# EAGLE design openmv (EAGLE 6.1)
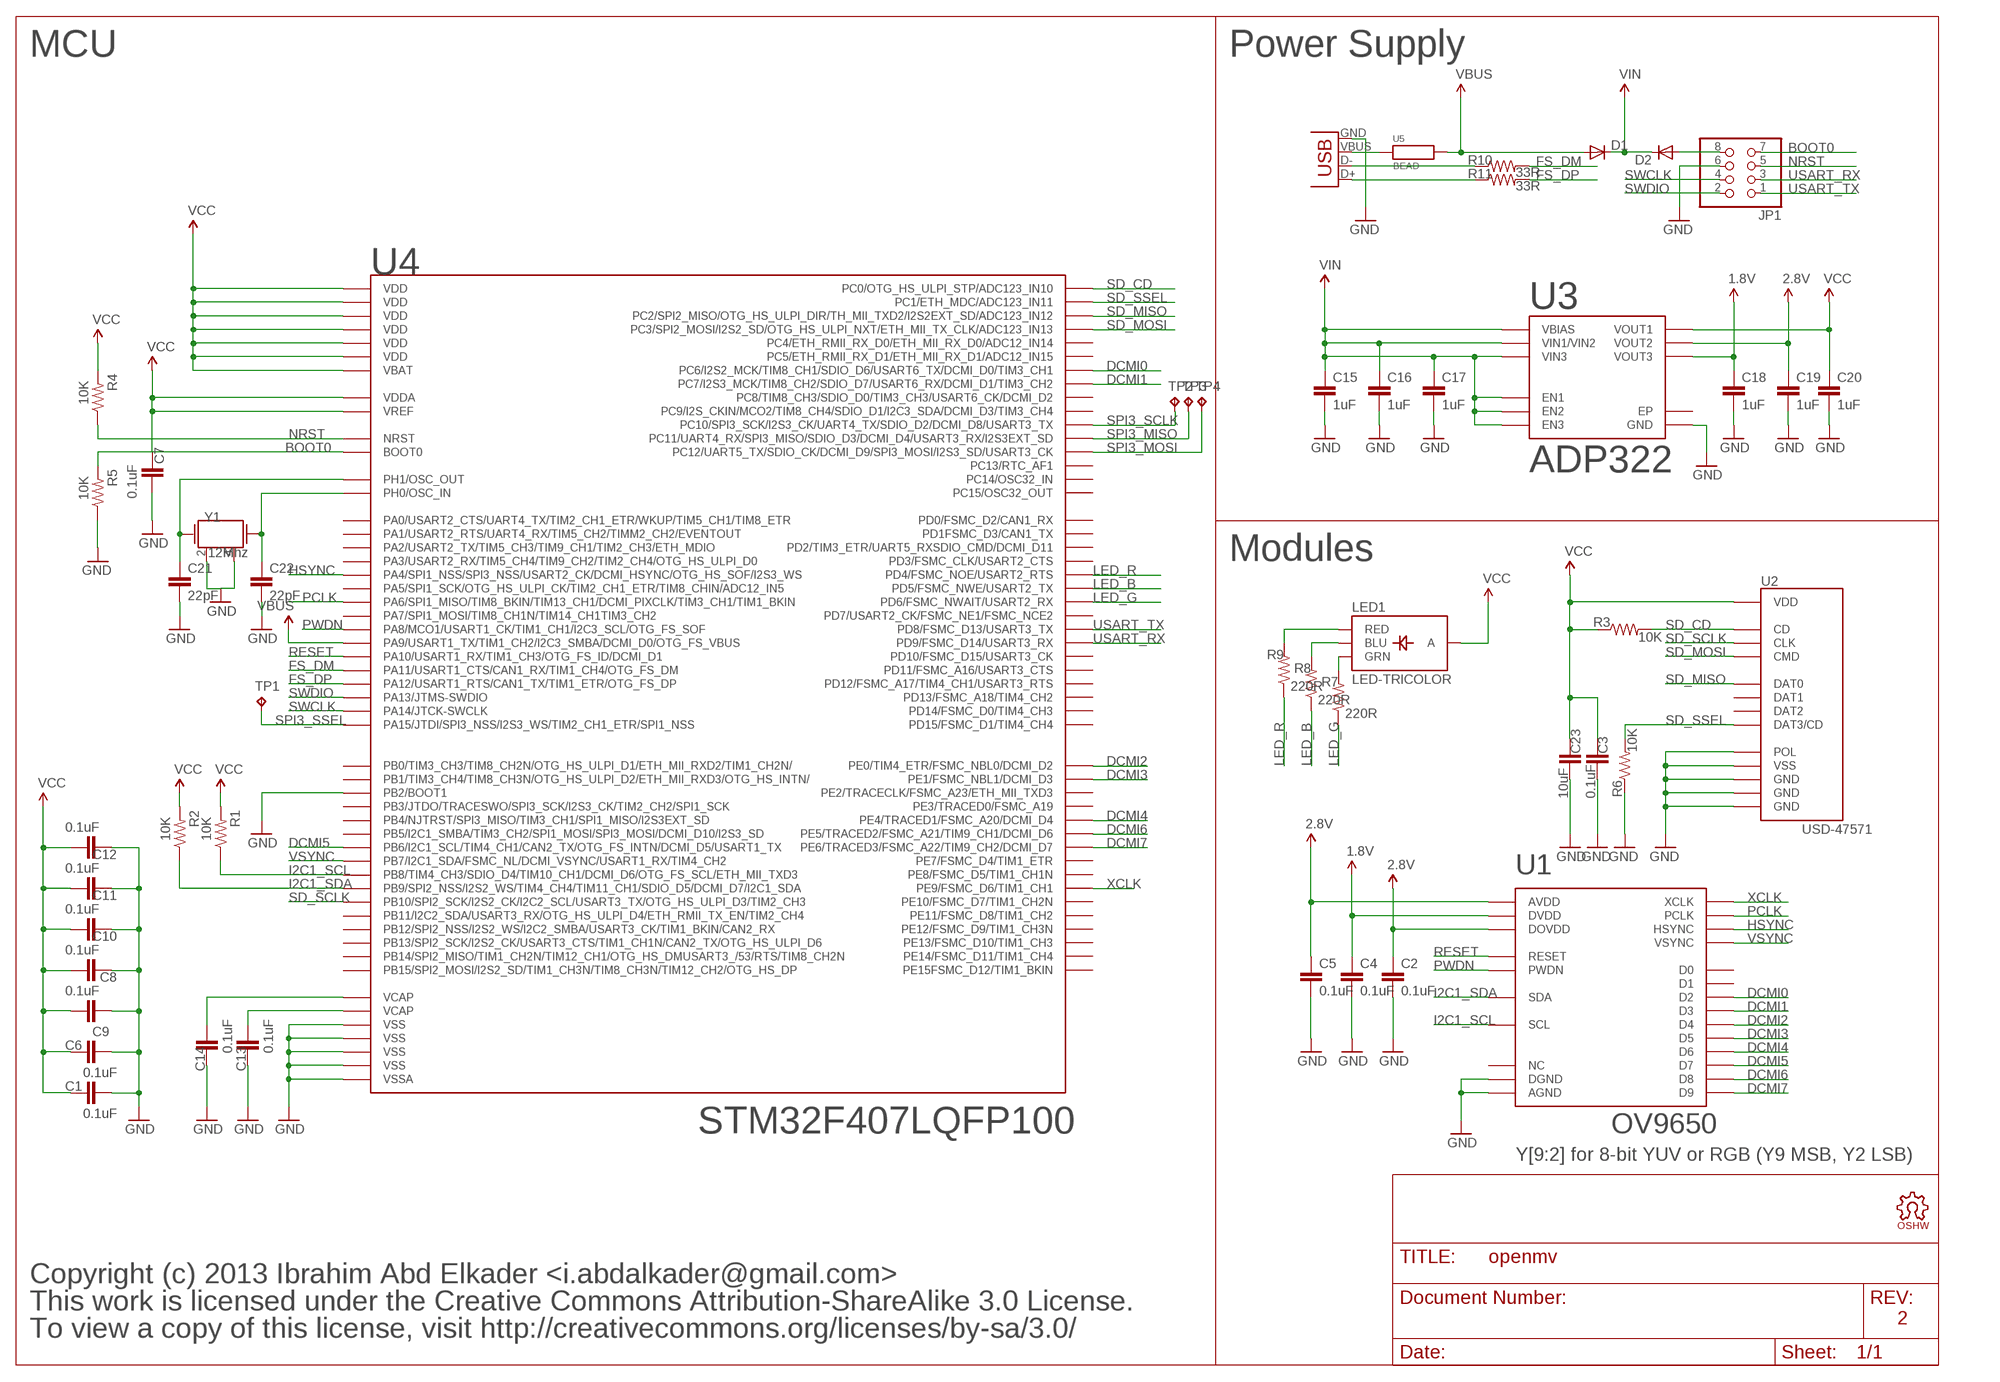
[diagram p0: schematic, sheet 1]

## Parts
C1  0.1uF  CAP0402-CAP  [0402-CAP]
C2  0.1uF  CAP0402-CAP  [0402-CAP]
C3  0.1uF  CAP0402-CAP  [0402-CAP]
C4  0.1uF  CAP0402-CAP  [0402-CAP]
C5  0.1uF  CAP0402-CAP  [0402-CAP]
C6  0.1uF  CAP0402-CAP  [0402-CAP]
C7  0.1uF  CAP0402-CAP  [0402-CAP]
C8  0.1uF  CAP0402-CAP  [0402-CAP]
C9  0.1uF  CAP0402-CAP  [0402-CAP]
C10  0.1uF  CAP0402-CAP  [0402-CAP]
C11  0.1uF  CAP0402-CAP  [0402-CAP]
C12  0.1uF  CAP0402-CAP  [0402-CAP]
C13  0.1uF  CAP0402-CAP  [0402-CAP]
C14  0.1uF  CAP0402-CAP  [0402-CAP]
C15  1uF  CAP0402-CAP  [0402-CAP]
C16  1uF  CAP0402-CAP  [0402-CAP]
C17  1uF  CAP0402-CAP  [0402-CAP]
C18  1uF  CAP0402-CAP  [0402-CAP]
C19  1uF  CAP0402-CAP  [0402-CAP]
C20  1uF  CAP0402-CAP  [0402-CAP]
C21  22pF  CAP0402-CAP  [0402-CAP]
C22  22pF  CAP0402-CAP  [0402-CAP]
C23  10uF  CAP0805  [0805]
D1  DIODESOD  [SOD-323]
D2  DIODESOD  [SOD-323]
JP1  PINHD-2X4  [2X04]
LED1  LED-TRICOLOR  [LED-TRICOLOR-SMD]
LOGO1  OSHW_LOGO_FILLX0150-NT  [OSHW_FILLX150_NOTEXT]
R1  10K  RESISTOR0402-RES  [0402-RES]
R2  10K  RESISTOR0402-RES  [0402-RES]
R3  10K  RESISTOR0402-RES  [0402-RES]
R4  10K  RESISTOR0402-RES  [0402-RES]
R5  10K  RESISTOR0402-RES  [0402-RES]
R6  10K  RESISTOR0402-RES  [0402-RES]
R7  220R  RESISTOR0402-RES  [0402-RES]
R8  220R  RESISTOR0402-RES  [0402-RES]
R9  220R  RESISTOR0402-RES  [0402-RES]
R10  33R  RESISTOR0402-RES  [0402-RES]
R11  33R  RESISTOR0402-RES  [0402-RES]
TP1  TPTP10R  [TP10R]
TP2  TPTP10R  [TP10R]
TP3  TPTP10R  [TP10R]
TP4  TPTP10R  [TP10R]
U1  OV9650  [OV9650]
U2  USD-47571  [USD-47571]
U3  ADP322  [WFQFN-16]
U4  STM32F407LQFP100  [LQFP100]
U5  BEAD  [0402-CAP]
X1  USB-MICROB  [USB-MICROB]
Y1  12Mhz  CRYSTAL5X3  [CRYSTAL-SMD-5X3]

## Nets
1.8V: C4.1 C18.1 U1.P$10(DVDD) U3.8(VOUT3)
2.8V: C2.1 C5.1 C19.1 U1.P$4(AVDD) U1.P$11(DOVDD) U3.6(VOUT2)
BOOT0: JP1.7 R5.2 U4.94(BOOT0)
DCMI0: U1.P$19(D2) U4.63(PC6/I2S2_MCK/TIM8_CH1/SDIO_D6/USART6_TX/DCMI_D0/TIM3_CH1)
DCMI1: U1.P$21(D3) U4.64(PC7/I2S3_MCK/TIM8_CH2/SDIO_D7/USART6_RX/DCMI_D1/TIM3_CH2)
DCMI2: U1.P$22(D4) U4.97(PE0/TIM4_ETR/FSMC_NBL0/DCMI_D2)
DCMI3: U1.P$20(D5) U4.98(PE1/FSMC_NBL1/DCMI_D3)
DCMI4: U1.P$18(D6) U4.3(PE4/TRACED1/FSMC_A20/DCMI_D4)
DCMI5: U1.P$16(D7) U4.92(PB6/I2C1_SCL/TIM4_CH1/CAN2_TX/OTG_FS_INTN/DCMI_D5/USART1_TX)
DCMI6: U1.P$14(D8) U4.4(PE5/TRACED2/FSMC_A21/TIM9_CH1/DCMI_D6)
DCMI7: U1.P$12(D9) U4.5(PE6/TRACED3/FSMC_A22/TIM9_CH2/DCMI_D7)
FS_DM: R10.2 U4.70(PA11/USART1_CTS/CAN1_RX/TIM1_CH4/OTG_FS_DM)
FS_DP: R11.2 U4.71(PA12/USART1_RTS/CAN1_TX/TIM1_ETR/OTG_FS_DP)
GND: C1.1 C2.2 C3.2 C4.2 C5.2 C6.1 C7.1 C8.2 C9.1 C10.2 C11.2 C12.2 C13.2 C14.2 C15.2 C16.2 C17.2 C18.2 C19.2 C20.2 C21.2 C22.2 C23.2 JP1.6 R5.1 R6.1 U1.P$2(AGND) U1.P$15(DGND) U2.G$1(GND) U2.G$2(GND) U2.G$3(GND) U2.G$4(POL) U2.P$6(VSS) U3.12(GND) U4.10(VSS) U4.20(VSSA) U4.27(VSS) U4.37(PB2/BOOT1) U4.74(VSS) U4.99(VSS) X1.GND Y1.2 Y1.4
HSYNC: U1.P$9(HSYNC) U4.29(PA4/SPI1_NSS/SPI3_NSS/USART2_CK/DCMI_HSYNC/OTG_HS_SOF/I2S3_WS)
I2C1_SCL: R1.1 U1.P$5(SCL) U4.95(PB8/TIM4_CH3/SDIO_D4/TIM10_CH1/DCMI_D6/OTG_FS_SCL/ETH_MII_TXD3)
I2C1_SDA: R2.1 U1.P$3(SDA) U4.96(PB9/SPI2_NSS/I2S2_WS/TIM4_CH4/TIM11_CH1/SDIO_D5/DCMI_D7/I2C1_SDA)
LED_B: R8.1 U4.86(PD5/FSMC_NWE/USART2_TX)
LED_G: R7.1 U4.87(PD6/FSMC_NWAIT/USART2_RX)
LED_R: R9.1 U4.85(PD4/FSMC_NOE/USART2_RTS)
N$6: LED1.G(GRN) R7.2
N$7: LED1.B(BLU) R8.2
N$9: C21.1 U4.13(PH1/OSC_OUT) Y1.1
N$10: C22.1 U4.12(PH0/OSC_IN) Y1.3
N$16: LED1.R(RED) R9.2
N$20: R10.1 X1.D-
N$21: R11.1 X1.D+
N$22: U5.1 X1.VBUS
NRST: JP1.5 R4.1 U4.14(NRST)
PCLK: U1.P$17(PCLK) U4.31(PA6/SPI1_MISO/TIM8_BKIN/TIM13_CH1/DCMI_PIXCLK/TIM3_CH1/TIM1_BKIN)
PWDN: U1.P$8(PWDN) U4.67(PA8/MCO1/USART1_CK/TIM1_CH1/I2C3_SCL/OTG_FS_SOF)
RAW: D2.2(A) JP1.8
RESET: U1.P$6(RESET) U4.69(PA10/USART1_RX/TIM1_CH3/OTG_FS_ID/DCMI_D1)
SD_CD: R3.2 U2.G$5(CD) U4.15(PC0/OTG_HS_ULPI_STP/ADC123_IN10)
SD_MISO: U2.P$7(DAT0) U4.17(PC2/SPI2_MISO/OTG_HS_ULPI_DIR/TH_MII_TXD2/I2S2EXT_SD/ADC123_IN12)
SD_MOSI: U2.P$3(CMD) U4.18(PC3/SPI2_MOSI/I2S2_SD/OTG_HS_ULPI_NXT/ETH_MII_TX_CLK/ADC123_IN13)
SD_SCLK: U2.P$5(CLK) U4.47(PB10/SPI2_SCK/I2S2_CK/I2C2_SCL/USART3_TX/OTG_HS_ULPI_D3/TIM2_CH3)
SD_SSEL: R6.2 U2.P$2(DAT3/CD) U4.16(PC1/ETH_MDC/ADC123_IN11)
SPI3_MISO: TP3.TP U4.79(PC11/UART4_RX/SPI3_MISO/SDIO_D3/DCMI_D4/USART3_RX/I2S3EXT_SD)
SPI3_MOSI: TP4.TP U4.80(PC12/UART5_TX/SDIO_CK/DCMI_D9/SPI3_MOSI/I2S3_SD/USART3_CK)
SPI3_SCLK: TP2.TP U4.78(PC10/SPI3_SCK/I2S3_CK/UART4_TX/SDIO_D2/DCMI_D8/USART3_TX)
SPI3_SSEL: TP1.TP U4.77(PA15/JTDI/SPI3_NSS/I2S3_WS/TIM2_CH1_ETR/SPI1_NSS)
SWCLK: JP1.4 U4.76(PA14/JTCK-SWCLK)
SWDIO: JP1.2 U4.72(PA13/JTMS-SWDIO)
USART_RX: JP1.3 U4.56(PD9/FSMC_D14/USART3_RX)
USART_TX: JP1.1 U4.55(PD8/FSMC_D13/USART3_TX)
VBUS: D1.2(A) U4.68(PA9/USART1_TX/TIM1_CH2/I2C3_SMBA/DCMI_D0/OTG_FS_VBUS) U5.2
VCAP1: C14.1 U4.49(VCAP)
VCAP2: C13.1 U4.73(VCAP)
VCC: C1.2 C3.1 C6.2 C7.2 C8.1 C9.2 C10.1 C11.1 C12.1 C20.1 C23.1 LED1.A R1.2 R2.2 R3.1 R4.2 U2.P$4(VDD) U3.5(VOUT1) U4.6(VBAT) U4.11(VDD) U4.19(VDD) U4.21(VREF) U4.22(VDDA) U4.28(VDD) U4.50(VDD) U4.75(VDD) U4.100(VDD)
VIN: C15.1 C16.1 C17.1 D1.1(C) D2.1(C) U3.1(EN1) U3.2(VBIAS) U3.3(VIN1/VIN2) U3.10(VIN3) U3.15(EN3) U3.16(EN2)
VSYNC: U1.P$7(VSYNC) U4.93(PB7/I2C1_SDA/FSMC_NL/DCMI_VSYNC/USART1_RX/TIM4_CH2)
XCLK: U1.P$13(XCLK) U4.40(PE9/FSMC_D6/TIM1_CH1)
Unconnected: U1.P$1(NC) U1.P$23(D1) U1.P$24(D0) U2.P$1(DAT2) U2.P$8(DAT1) U3.4(NC) U3.7(NC) U3.9(NC) U3.11(NC) U3.13(NC) U3.14(NC) U3.EXP(EP) U4.1(PE2/TRACECLK/FSMC_A23/ETH_MII_TXD3) U4.2(PE3/TRACED0/FSMC_A19) U4.7(PC13/RTC_AF1) U4.8(PC14/OSC32_IN) U4.9(PC15/OSC32_OUT) U4.23(PA0/USART2_CTS/UART4_TX/TIM2_CH1_ETR/WKUP/TIM5_CH1/TIM8_ETR) U4.24(PA1/USART2_RTS/UART4_RX/TIM5_CH2/TIMM2_CH2/EVENTOUT) U4.25(PA2/USART2_TX/TIM5_CH3/TIM9_CH1/TIM2_CH3/ETH_MDIO) U4.26(PA3/USART2_RX/TIM5_CH4/TIM9_CH2/TIM2_CH4/OTG_HS_ULPI_D0) U4.30(PA5/SPI1_SCK/OTG_HS_ULPI_CK/TIM2_CH1_ETR/TIM8_CHIN/ADC12_IN5) U4.32(PA7/SPI1_MOSI/TIM8_CH1N/TIM14_CH1TIM3_CH2) U4.33(PC4/ETH_RMII_RX_D0/ETH_MII_RX_D0/ADC12_IN14) U4.34(PC5/ETH_RMII_RX_D1/ETH_MII_RX_D1/ADC12_IN15) U4.35(PB0/TIM3_CH3/TIM8_CH2N/OTG_HS_ULPI_D1/ETH_MII_RXD2/TIM1_CH2N/) U4.36(PB1/TIM3_CH4/TIM8_CH3N/OTG_HS_ULPI_D2/ETH_MII_RXD3/OTG_HS_INTN/) U4.38(PE7/FSMC_D4/TIM1_ETR) U4.39(PE8/FSMC_D5/TIM1_CH1N) U4.41(PE10/FSMC_D7/TIM1_CH2N) U4.42(PE11/FSMC_D8/TIM1_CH2) U4.43(PE12/FSMC_D9/TIM1_CH3N) U4.44(PE13/FSMC_D10/TIM1_CH3) U4.45(PE14/FSMC_D11/TIM1_CH4) U4.46(PE15FSMC_D12/TIM1_BKIN) U4.48(PB11/I2C2_SDA/USART3_RX/OTG_HS_ULPI_D4/ETH_RMII_TX_EN/TIM2_CH4) U4.51(PB12/SPI2_NSS/I2S2_WS/I2C2_SMBA/USART3_CK/TIM1_BKIN/CAN2_RX) U4.52(PB13/SPI2_SCK/I2S2_CK/USART3_CTS/TIM1_CH1N/CAN2_TX/OTG_HS_ULPI_D6) U4.53(PB14/SPI2_MISO/TIM1_CH2N/TIM12_CH1/OTG_HS_DMUSART3_/53/RTS/TIM8_CH2N) U4.54(PB15/SPI2_MOSI/I2S2_SD/TIM1_CH3N/TIM8_CH3N/TIM12_CH2/OTG_HS_DP) U4.57(PD10/FSMC_D15/USART3_CK) U4.58(PD11/FSMC_A16/USART3_CTS) U4.59(PD12/FSMC_A17/TIM4_CH1/USART3_RTS) U4.60(PD13/FSMC_A18/TIM4_CH2) U4.61(PD14/FSMC_D0/TIM4_CH3) U4.62(PD15/FSMC_D1/TIM4_CH4) U4.65(PC8/TIM8_CH3/SDIO_D0/TIM3_CH3/USART6_CK/DCMI_D2) U4.66(PC9/I2S_CKIN/MCO2/TIM8_CH4/SDIO_D1/I2C3_SDA/DCMI_D3/TIM3_CH4) U4.81(PD0/FSMC_D2/CAN1_RX) U4.82(PD1FSMC_D3/CAN1_TX) U4.83(PD2/TIM3_ETR/UART5_RXSDIO_CMD/DCMI_D11) U4.84(PD3/FSMC_CLK/USART2_CTS) U4.88(PD7/USART2_CK/FSMC_NE1/FSMC_NCE2) U4.89(PB3/JTDO/TRACESWO/SPI3_SCK/I2S3_CK/TIM2_CH2/SPI1_SCK) U4.90(PB4/NJTRST/SPI3_MISO/TIM3_CH1/SPI1_MISO/I2S3EXT_SD) U4.91(PB5/I2C1_SMBA/TIM3_CH2/SPI1_MOSI/SPI3_MOSI/DCMI_D10/I2S3_SD)

## Notes on the sheet
- MCU | Power Supply
- Modules
- Y[9:2] for 8-bit YUV or RGB (Y9 MSB, Y2 LSB)
- Copyright (c) 2013 Ibrahim Abd Elkader <i.abdalkader@gmail.com>
- This work is licensed under the Creative Commons Attribution-ShareAlike 3.0 License.
- 2
- To view a copy of this license, visit http://creativecommons.org/licenses/by-sa/3.0/

## Library data of the parts
C1-C23 = sfe:CAP: Capacitor Standard 0603 ceramic capacitor, and 0.1" leaded capacitor.
D1 D2 = sfe:DIODE: Diode These are standard reverse protection diodes and small signal diodes. SMA package can handle up to about 1A. SOD-323 can handle about 200mA. What the SOD-323 package when ordering, there are some mfgs out there that are 5-pin packages.
JP1 = pinhead:PINHD-2X4: PIN HEADER
LED1 = sfe:LED-TRICOLOR: Tri-Color LED SMD Proven layout and schematic for triple color LED in SMD package - common anode. Spark Fun Electronics SKU : COM-07844
LOGO1 = iofault:OSHW_LOGO_FILL
R1-R11 = sfe:RESISTOR: Resistor Basic schematic elements and footprints for 0603, 1206, and PTH resistors.
TP1-TP4 = testpad:TP: Test pad
U1 = iofault:OV9650
U2 = mux:USD-47571
U3 = iofault:ADP322
U4 = mux:STM32F407
U5 = heka:BEAD
X1 = sfe:USB: USB Connectors USB-B-PTH is fully proven SKU : PRT-00139 USB-miniB is fully proven SKU : PRT-00587 USB-A-PCB is untested. USB-A-H is throughly reviewed, but untested. Spark Fun Electronics SKU : PRT-00437 USB-B-SMT is throughly reviewed, but untested. Needs silkscreen touching up. USB-A-S has not been used/tested USB-MB-H has not been used/tested
Y1 = mux:CRYSTAL: Crystals Various standard crystals. Proven footprints. Spark Fun Electronics SKU : COM-00534

## Board
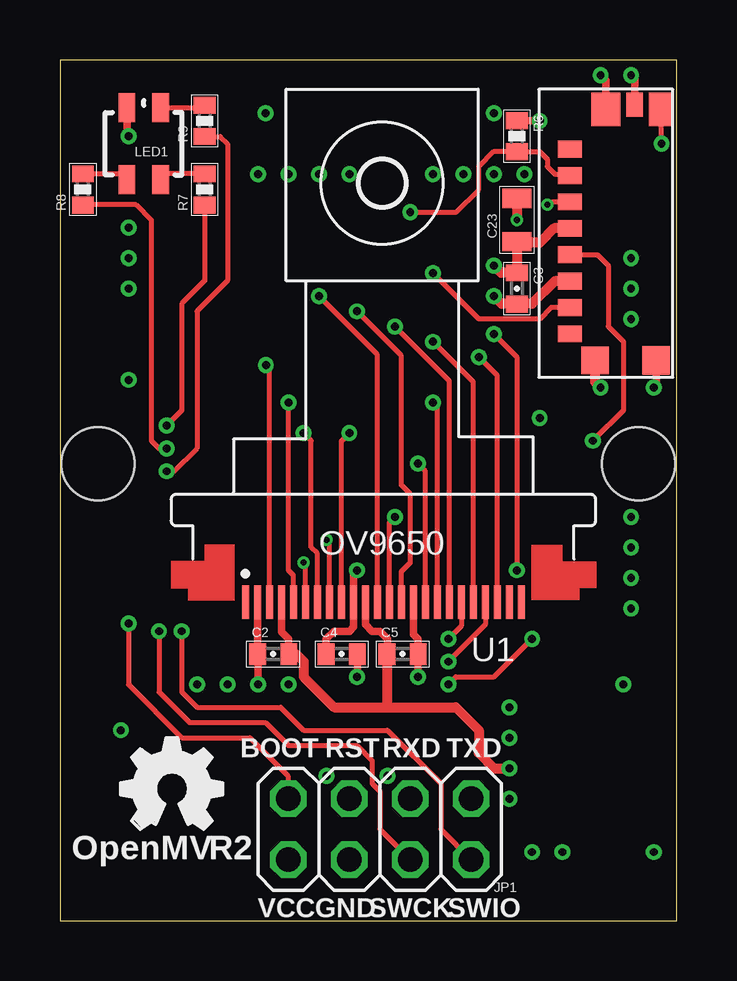
[diagram p1: board, top side]
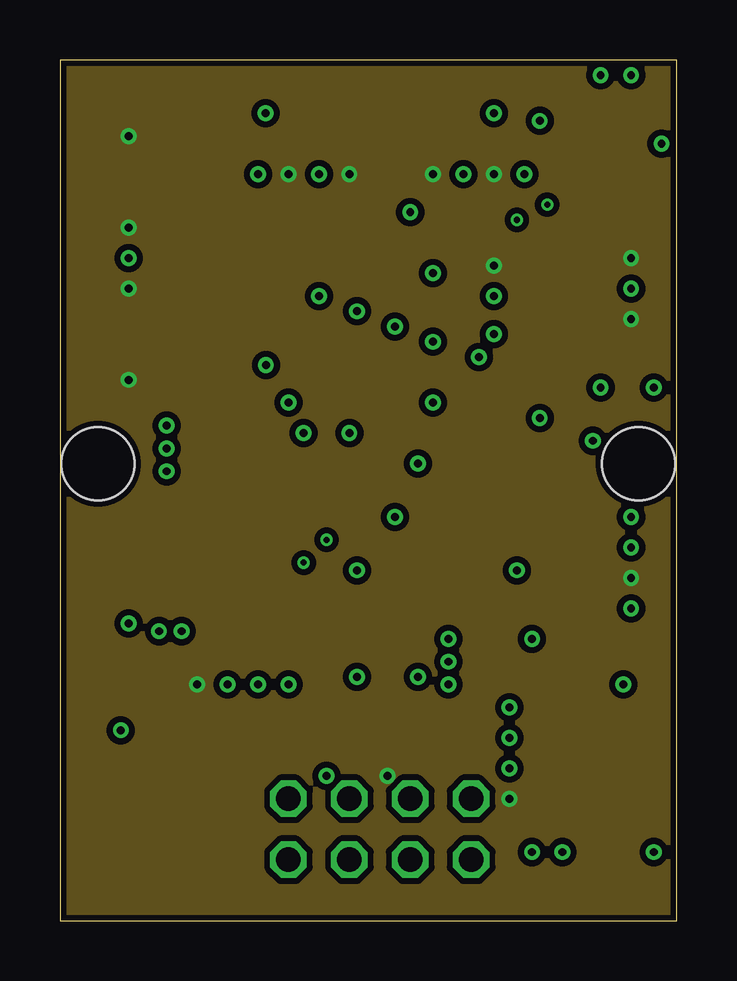
[diagram p2: board, inner layer Route2]
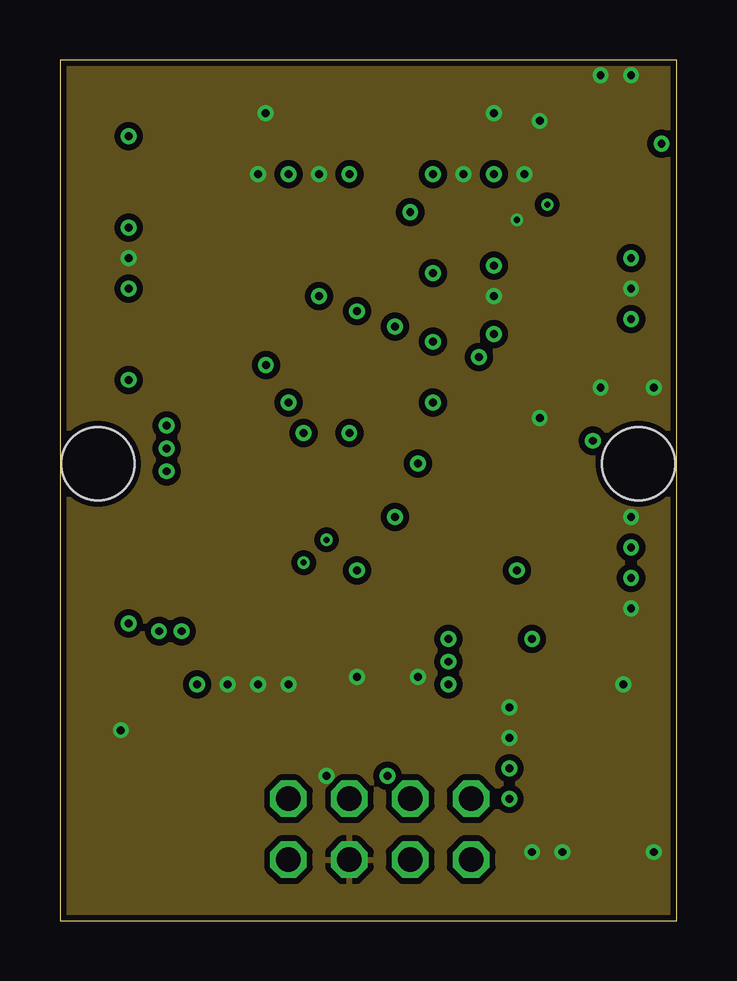
[diagram p3: board, inner layer Route15]
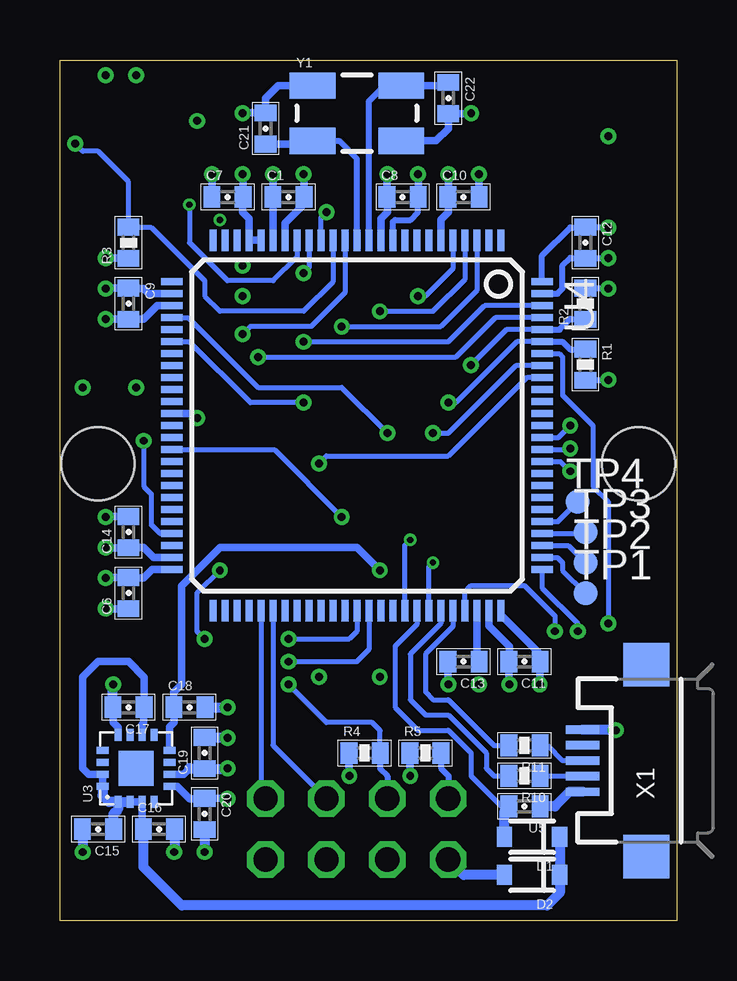
[diagram p4: board, bottom side, seen from below]

Size 25.72 x 35.88 mm. Coordinates in mm from the lower left corner, seen from the top.
Outline: 0,0 25.72,0 25.72,35.88 0,35.88 0,0
Copper layers (1*2+15*16): Top 0.035mm / dielectric 1.5mm / Route2 0.035mm / dielectric 0.15mm / Route15 0.035mm / dielectric 0.2mm / Bottom 0.035mm
Design rules: minimum track width 8mil, minimum drill 10mil, track to track 6mil, track to pad 6mil, pad to pad 6mil, via to via 6mil, smd to smd 6mil, copper to edge 10mil, drill to drill 10mil, minimum pad ring 10mil, minimum via ring 4mil, stop-mask expansion 2mil, vias tented up to drill 20mil, thermal gap 10mil
Holes 3.05 mm at 1.59,19.05 24.13,19.05

### Footprints (pad centres in the part's own frame; a part is rotated, then mirrored left to right if it is on the bottom)
0402-CAP = smd 0.7 x 0.9: 1 -0.65,0; 2 0.65,0
0805 = smd 0.8 x 1.2: 1 -0.9,0; 2 0.9,0
SOD-323 = smd 0.63 x 0.83: 1 -1.15,0; 2 1.15,0
2X04 = drill 1.016 octagon: 1 -3.81,-1.27; 2 -3.81,1.27; 3 -1.27,-1.27; 4 -1.27,1.27; 5 1.27,-1.27; 6 1.27,1.27; 7 3.81,-1.27; 8 3.81,1.27
LED-TRICOLOR-SMD = smd 0.7 x 1.2: A 0.7,-1.5; B 0.7,1.5; G -0.7,1.5; R -0.7,-1.5
0402-RES = smd 0.7 x 0.9: 1 -0.65,0; 2 0.65,0
TP10R = smd 1 x 1: TP 0,0
OV9650 = smd 0.3 x 1.4: P$1 -5.6,-11.5; P$2 -5.1,-11.5; P$3 -4.6,-11.5; P$4 -4.1,-11.5; P$5 -3.6,-11.5; P$6 -3.1,-11.5; P$7 -2.6,-11.5; P$8 -2.1,-11.5; P$9 -1.6,-11.5; P$10 -1.1,-11.5; P$11 -0.6,-11.5; P$12 -0.1,-11.5; P$13 0.4,-11.5; P$14 0.9,-11.5; P$15 1.4,-11.5; P$16 1.9,-11.5; P$17 2.4,-11.5; P$18 2.9,-11.5; P$19 3.4,-11.5; P$20 3.9,-11.5; P$21 4.4,-11.5; P$22 4.9,-11.5; P$23 5.4,-11.5; P$24 5.9,-11.5
USD-47571 = smd 1.15 x 1.15: G$1 -4.9,0.55 | smd 1.2 x 1.15: G$2 -4.9,-2 | smd 1.4 x 1.2: G$3 5.55,0.1 | smd 1 x 0.7: G$4 5.75,-1.1 | smd 1.4 x 0.9: G$5 5.55,-2.15 | smd 0.7 x 1: P$1 3.9,1.6; P$2 2.8,1.6; P$3 1.7,1.6; P$4 0.6,1.6; P$5 -0.5,1.6; P$6 -1.6,1.6; P$7 -2.7,1.6; P$8 -3.8,1.6
WFQFN-16 = smd 0.5 x 0.3: 1 -1.4,0.75; 2 -1.4,0.25; 3 -1.4,-0.25; 4 -1.4,-0.75; 9 1.4,-0.75; 10 1.4,-0.25; 11 1.4,0.25; 12 1.4,0.75 | smd 0.3 x 0.5: 5 -0.75,-1.4; 6 -0.25,-1.4; 7 0.25,-1.4; 8 0.75,-1.4; 13 0.75,1.4; 14 0.25,1.4; 15 -0.25,1.4; 16 -0.75,1.4 | smd 1.45 x 1.45: EXP 0,0
LQFP100 = smd 0.9 x 0.3: 1 -7.72,6; 2 -7.72,5.5; 3 -7.72,5; 4 -7.72,4.5; 5 -7.72,4; 6 -7.72,3.5; 7 -7.72,3; 8 -7.72,2.5; 9 -7.72,2; 10 -7.72,1.5; 11 -7.72,1; 12 -7.72,0.5; 13 -7.72,0; 14 -7.72,-0.5; 15 -7.72,-1; 16 -7.72,-1.5; 17 -7.72,-2; 18 -7.72,-2.5; 19 -7.72,-3; 20 -7.72,-3.5; 21 -7.72,-4; 22 -7.72,-4.5; 23 -7.72,-5; 24 -7.72,-5.5; 25 -7.72,-6; 51 7.72,-6; 52 7.72,-5.5; 53 7.72,-5; 54 7.72,-4.5; 55 7.72,-4; 56 7.72,-3.5; 57 7.72,-3; 58 7.72,-2.5; 59 7.72,-2; 60 7.72,-1.5; 61 7.72,-1; 62 7.72,-0.5; 63 7.72,0; 64 7.72,0.5; 65 7.72,1; 66 7.72,1.5; 67 7.72,2; 68 7.72,2.5; 69 7.72,3; 70 7.72,3.5; 71 7.72,4; 72 7.72,4.5; 73 7.72,5; 74 7.72,5.5; 75 7.72,6 | smd 0.3 x 0.9: 26 -6,-7.72; 27 -5.5,-7.72; 28 -5,-7.72; 29 -4.5,-7.72; 30 -4,-7.72; 31 -3.5,-7.72; 32 -3,-7.72; 33 -2.5,-7.72; 34 -2,-7.72; 35 -1.5,-7.72; 36 -1,-7.72; 37 -0.5,-7.72; 38 0,-7.72; 39 0.5,-7.72; 40 1,-7.72; 41 1.5,-7.72; 42 2,-7.72; 43 2.5,-7.72; 44 3,-7.72; 45 3.5,-7.72; 46 4,-7.72; 47 4.5,-7.72; 48 5,-7.72; 49 5.5,-7.72; 50 6,-7.72; 76 6,7.72; 77 5.5,7.72; 78 5,7.72; 79 4.5,7.72; 80 4,7.72; 81 3.5,7.72; 82 3,7.72; 83 2.5,7.72; 84 2,7.72; 85 1.5,7.72; 86 1,7.72; 87 0.5,7.72; 88 0,7.72; 89 -0.5,7.72; 90 -1,7.72; 91 -1.5,7.72; 92 -2,7.72; 93 -2.5,7.72; 94 -3,7.72; 95 -3.5,7.72; 96 -4,7.72; 97 -4.5,7.72; 98 -5,7.72; 99 -5.5,7.72; 100 -6,7.72
USB-MICROB = smd 0.35 x 1.4: D+ 0,2.65; D- -0.65,2.65; GND 1.3,2.65; ID 0.65,2.65; VBUS -1.3,2.65 | smd 1.8 x 1.9: MT1 -4,0; MT2 4,0
CRYSTAL-SMD-5X3 = smd 1.9 x 1.1: 1 -1.85,-1.15; 2 1.85,-1.15; 3 1.85,1.15; 4 -1.85,1.15

### Placement (x,y rotation side)
C1  16.19,30.16 0 bottom
C2  8.89,11.11 180 top
C3  19.05,26.35 270 top
C4  11.75,11.11 0 top
C5  14.29,11.11 0 top
C6  22.86,13.65 90 bottom
C7  18.73,30.16 0 bottom
C8  11.43,30.16 0 bottom
C9  22.86,25.72 270 bottom
C10  8.89,30.16 0 bottom
C11  6.35,10.79 180 bottom
C12  3.81,28.26 270 bottom
C13  8.89,10.79 180 bottom
C14  22.86,16.19 90 bottom
C15  24.13,3.81 180 bottom
C16  21.59,3.81 0 bottom
C17  22.86,8.89 180 bottom
C18  20.32,8.89 0 bottom
C19  19.68,6.99 90 bottom
C20  19.68,4.45 270 bottom
C21  17.14,33.02 90 bottom
C22  9.53,34.29 270 bottom
C23  19.05,29.21 90 top
D1  6.03,3.49 180 bottom
D2  6.03,1.91 180 bottom
JP1  13.34,3.81 180 top
LED1  3.49,32.38 180 top
LOGO1  2.54,3.81 0 top
R1  3.81,23.18 270 bottom
R2  3.81,25.72 90 bottom
R3  22.86,28.26 90 bottom
R4  13.02,6.99 180 bottom
R5  10.48,6.99 0 bottom
R6  19.05,32.7 270 top
R7  6.03,30.48 90 top
R8  0.95,30.48 90 top
R9  6.03,33.34 90 top
R10  6.35,6.03 180 bottom
R11  6.35,7.3 180 bottom
TP1  3.81,13.65 0 bottom
TP2  3.81,14.92 0 bottom
TP3  3.81,16.19 0 bottom
TP4  4.13,17.46 0 bottom
U1  13.34,24.77 0 top
U2  22.86,28.26 90 top
U3  22.54,6.35 90 bottom
U4  13.34,20.64 270 bottom
U5  6.35,4.76 180 bottom
X1  1.27,6.67 90 bottom
Y1  13.34,33.66 0 bottom

### Tracks (layer width: path | path; a pad name or v marks a point on that pad's centre or on a via)
1.8V  (via drill 0.33)
  Top 0.305: v12.38,14.61 12.23,14.46 U1.P$10 12.23,12.23 12.06,12.06 11.43,12.06 11.1,11.73 C4.1
  Bottom 0.305: U3.8 21.14,8.07 20.95,8.26 20.95,8.88 C18.1 20.97,9.51 20.64,9.84 20.64,13.94 20.65,13.96 19.05,15.56 13.34,15.56 v12.38,14.61
2.8V  (via drill 0.33)
  Top 0.305: U1.P$4 9.23,12.04 9.53,11.75 9.53,11.13 | U1.P$11 12.73,12.35 13.02,12.06 13.34,12.06 13.65,11.75 13.65,11.13 C5.1
  Top 0.406: 13.65,8.89 11.43,8.89 10.16,10.16 10.16,10.79 9.84,11.11 C2.1 9.53,11.13 | 13.65,8.89 16.51,8.89 17.46,7.94 17.46,6.99 18.1,6.35 v18.73,6.35 | C5.1 13.64,8.9 13.65,8.89
  Bottom 0.305: U3.6 20.57,6.1 20.32,6.35
  Bottom 0.406: v18.73,6.35 18.75,6.33 C19.1 19.7,6.35 20.32,6.35
BOOT0  (via drill 0.33)
  Top 0.203: v2.86,12.38 2.86,9.84 5.08,7.62 7.92,7.62 9.51,6.03 9.51,5.09 JP1.7
  Bottom 0.203: U4.94 4.91,23.64 4.76,23.5 4.76,21.91 3.49,20.64 3.49,18.1 2.86,17.46 v2.86,12.38
  Bottom 0.254: R5.2 9.83,6.35 9.51,6.03 9.51,5.09 JP1.7
DCMI0  (via drill 0.33)
  Top 0.203: v16.19,11.75 16.73,12.29 U1.P$19
  Bottom 0.203: v16.19,11.75 13.65,11.75 13.34,12.06 U4.63
DCMI1  (via drill 0.33)
  Top 0.203: v16.19,10.79 17.73,12.34 U1.P$21
  Bottom 0.203: v16.19,10.79 13.34,10.79 12.84,11.29 U4.64
DCMI2  (via drill 0.33)
  Top 0.203: U1.P$22 18.23,22.72 v17.46,23.5
  Bottom 0.203: v17.46,23.5 9.21,23.5 7.57,25.14 U4.97
DCMI3  (via drill 0.33)
  Top 0.203: U1.P$20 17.23,22.45 v15.56,24.13
  Bottom 0.203: v15.56,24.13 9.53,24.13 8.02,25.64 U4.98
DCMI4  (via drill 0.33)
  Top 0.203: U1.P$18 16.23,22.5 v13.97,24.77
  Bottom 0.203: v13.97,24.77 9.84,24.77 8.34,26.27 U4.3
DCMI5  (via drill 0.33)
  Top 0.203: v14.92,19.05 15.23,18.74 U1.P$16
  Bottom 0.203: v14.92,19.05 14.61,19.37 9.53,19.37 6.25,22.64 U4.92
DCMI6  (via drill 0.33)
  Top 0.203: v12.38,25.4 14.23,23.55 14.23,18.15 14.61,17.78 14.61,14.92 14.23,14.55 U1.P$14
  Bottom 0.203: v12.38,25.4 10.16,25.4 8.84,26.73 U4.4
DCMI7  (via drill 0.33)
  Top 0.203: v10.79,26.04 13.23,23.59 U1.P$12
  Bottom 0.203: U4.5 9.34,27.18 10.48,26.04 v10.79,26.04
FS_DM
  Bottom 0.203: U4.70 9.84,12.39 11.11,11.11 11.11,9.21 10.48,8.57 9.53,8.57 7.94,6.99 7.94,6.35 7.62,6.03 R10.2
FS_DP
  Bottom 0.203: U4.71 9.34,12.26 10.48,11.11 10.48,9.53 10.16,9.21 9.53,9.21 7.62,7.3 R11.2
GND  (via drill 0.25, 0.33)
  Top 0.305: C2.2 8.26,11.13 8.26,11.11 | U1.P$2 8.23,11.13 8.26,11.11 | U1.P$15 14.73,11.94 14.92,11.75 14.92,11.13 | 14.92,11.13 C5.2 | 14.92,11.13 v14.92,10.16 | 8.26,11.11 v8.26,9.84 | C4.2 12.4,10.18 v12.38,10.16 | U2.G$4 23.96,35.09 v23.81,35.24 | v22.54,35.24 22.76,35.02 U2.G$3 | U2.G$2 24.86,22.32 v24.77,22.23 | R6.1 19.99,33.35 v20,33.34
  Top 0.406: C23.2 v19.05,29.21 | U2.G$1 22.31,22.46 v22.54,22.23 | 19.07,25.72 18.41,25.72 v18.1,26.04 | U2.P$6 20.62,26.66 19.68,25.72 19.07,25.72 | 19.07,25.72 C3.2
  Bottom 0.254: U4.99 4.98,26.14 4.76,26.35 4.76,27.3 4.45,27.62 3.83,27.62 C12.2 2.87,27.61 v2.86,27.62 | U4.10 11.84,29.12 11.75,29.21 11.11,29.21 10.79,29.53 10.79,30.15 C8.2
  Bottom 0.305: U4.27 22.01,26.14 22.23,26.35 22.84,26.35 C9.1 23.8,26.37 v23.81,26.35 | C6.1 23.8,13 v23.81,13.02 | C14.2 23.8,16.84 v23.81,16.83 | v6.99,9.84 7,9.86 C11.2 6.99,10.81 6.99,11.43 7.83,12.28 U4.74 | C8.2 v10.78,31.1 v10.79,31.11 | C10.2 8.24,31.1 v8.26,31.11 | v16.83,31.11 16.84,31.1 C1.1 U4.20 | U4.37 20.18,21.14 v20,20.95 | v8.57,33.66 8.59,33.64 C22.2 9.53,33.02 10.04,32.51 Y1.2 | Y1.4 16.63,34.8 17.14,34.29 C21.2 18.08,33.67 v18.1,33.66 | U3.12 23.29,8.05 23.5,8.26 23.5,8.88 C17.2 | R5.1 11.13,6.05 v11.11,6.03 | C13.2 9.54,9.86 v9.53,9.84 | C7.1 19.38,31.1 v19.37,31.11
  Bottom 0.406: C15.2 24.78,2.87 v24.77,2.86 | C16.2 20.94,2.87 v20.95,2.86 | C20.2 v19.68,2.86 | C19.2 18.75,7.63 v18.73,7.62 | C17.2 23.51,9.83 v23.5,9.84 | X1.GND 2.57,7.97 v2.54,7.94 | C18.2 v18.73,8.89
  pour Route15 (isolate 0.254): 0,0 0,35.88 25.72,35.88 25.72,0
HSYNC  (via drill 0.33)
  Top 0.203: U1.P$9 11.73,19.99 v12.06,20.32
  Bottom 0.203: U4.29 20.38,25.14 17.46,22.23 13.97,22.23 v12.06,20.32
I2C1_SCL  (via drill 0.33)
  Top 0.203: U1.P$5 9.73,14.39 9.53,14.61 v9.53,21.59
  Bottom 0.203: v9.53,21.59 9.21,21.59 6.66,24.14 U4.95
  Bottom 0.254: U4.95 4.77,24.14 4.45,23.81 3.83,23.81 R1.1
I2C1_SDA  (via drill 0.33)
  Top 0.203: U1.P$3 8.73,23.02 v8.59,23.16
  Bottom 0.203: U4.96 7.11,24.64 v8.59,23.16
  Bottom 0.254: U4.96 4.89,24.64 4.45,25.08 3.83,25.08 R2.1
LED_B  (via drill 0.33)
  Top 0.203: v4.45,19.68 4.13,19.68 3.81,20 3.81,29.21 3.17,29.84 0.97,29.84 R8.1
  Bottom 0.203: U4.86 4.49,19.64 v4.45,19.68
LED_G  (via drill 0.33)
  Top 0.203: R7.1 6.03,26.67 5.08,25.72 5.08,21.27 v4.45,20.64
  Bottom 0.203: U4.87 4.95,20.14 v4.45,20.64
LED_R  (via drill 0.33)
  Top 0.203: v4.45,18.73 4.76,18.73 5.71,19.68 5.71,25.4 6.99,26.67 6.99,32.38 6.68,32.69 R9.1
  Bottom 0.203: U4.85 4.85,19.14 v4.45,18.73
N$6
  Top 0.203: R7.2 4.44,31.13 LED1.G
N$7
  Top 0.203: R8.2 2.55,31.13 LED1.B
N$9
  Bottom 0.254: U4.13 13.34,31.75 14.09,32.51 Y1.1
  Bottom 0.305: C21.1 15.32,32.37 Y1.1
N$10
  Bottom 0.254: Y1.3 12.19,34.8 12.84,34.16 U4.12
  Bottom 0.305: Y1.3 9.66,34.8 C22.1
N$16
  Top 0.203: LED1.R 5.93,33.88 R9.2
N$20
  Bottom 0.203: X1.D- 5.68,6.02 R10.1
N$21
  Bottom 0.203: X1.D+ 4.76,6.67 5.4,7.3 R11.1
N$22
  Bottom 0.406: X1.VBUS 4.47,5.37 5.08,4.76 U5.1
NRST  (via drill 0.33)
  Top 0.203: v18.1,24.45 19.05,23.5 v19.05,14.61 | v16.19,9.84 16.51,10.16 18.1,10.16 v19.68,11.75
  Bottom 0.203: v18.1,24.45 17.78,24.77 15.24,24.77 13.84,26.17 U4.14 | v19.05,14.61 20,13.65 20,12.06 v19.68,11.75 | v16.19,9.84 14.61,8.26 12.7,8.26 12.37,7.92 R4.1
  Bottom 0.254: R4.1 12.37,6.33 12.06,6.03 JP1.5
PCLK  (via drill 0.33)
  Top 0.203: U1.P$17 15.73,21.41 v15.56,21.59
  Bottom 0.203: v15.56,21.59 17.78,21.59 20.33,24.14 U4.31
PWDN  (via drill 0.25)
  Top 0.203: U1.P$8 11.23,15.75 v11.11,15.88
  Bottom 0.203: U4.67 11.34,15.65 v11.11,15.88
RAW
  Bottom 0.406: D2.2 8.89,1.91 JP1.8
RESET  (via drill 0.25)
  Top 0.203: U1.P$6 10.23,14.85 v10.16,14.92
  Bottom 0.203: U4.69 10.34,14.75 v10.16,14.92
SD_CD  (via drill 0.33)
  Top 0.203: v25.08,32.38 25.08,33.73 U2.G$5
  Bottom 0.203: U4.15 14.34,26.62 15.56,25.4 19.05,25.4 19.68,26.04 19.68,26.67 21.92,28.91 R3.2 22.86,30.8 24.13,32.07 24.77,32.07 v25.08,32.38
SD_MISO  (via drill 0.33)
  Top 0.203: v15.56,26.99 16.67,25.88 16.99,25.56 17.46,25.08 20,25.08 20.48,25.56 U2.P$7
  Bottom 0.203: U4.17 15.34,27.21 v15.56,26.99
SD_MOSI  (via drill 0.25)
  Top 0.203: U2.P$3 20.43,29.96 v20.32,29.84
  Bottom 0.203: U4.18 15.84,27.66 16.83,26.67 18.73,26.67 20.32,28.26 v20.32,29.84
SD_SCLK  (via drill 0.33)
  Top 0.203: v22.23,20 23.5,21.27 23.5,24.13 22.86,24.77 22.86,27.3 22.41,27.76 U2.P$5
  Bottom 0.203: v22.23,20 22.23,18.1 21.91,17.78 21.91,16.51 21.54,16.14 U4.47
SD_SSEL  (via drill 0.33)
  Top 0.203: U2.P$2 21.2,31.11 20.64,31.11 20.32,31.43 20.32,31.75 20.02,32.05 R6.2 19.04,32.07 18.1,32.07 17.46,31.43 17.46,30.48 16.51,29.53 v14.61,29.53
  Bottom 0.203: U4.16 14.84,29.3 v14.61,29.53
SPI3_MISO
  Bottom 0.203: U4.79 3.87,16.14 TP3.TP
SPI3_MOSI
  Bottom 0.203: U4.80 4.95,16.64 TP4.TP
SPI3_SCLK
  Bottom 0.203: U4.78 4.53,15.64 TP2.TP
SPI3_SSEL
  Bottom 0.203: U4.77 4.98,15.14 4.76,14.92 4.76,14.61 TP1.TP
SWCLK  (via drill 0.33)
  Top 0.203: v4.13,12.06 4.13,9.53 5.4,8.26 8.57,8.26 9.53,7.3 12.38,7.3 13.02,6.67 13.02,5.71 13.34,5.4 13.34,3.81 JP1.4
  Bottom 0.203: U4.76 5.62,13.87 4.13,12.38 v4.13,12.06
SWDIO  (via drill 0.33)
  Top 0.203: v5.08,12.06 5.08,9.53 5.71,8.89 9.21,8.89 10.16,7.94 13.65,7.94 15.88,5.71 15.88,3.81 JP1.2
  Bottom 0.203: U4.72 8.84,13.71 8.57,13.97 6.35,13.97 5.08,12.7 v5.08,12.06
USART_RX
  Bottom 0.203: U4.56 16.84,7.31 JP1.3
USART_TX
  Bottom 0.203: U4.55 17.34,5.27 JP1.1
VBUS
  Bottom 0.203: U4.68 10.84,12.34 11.75,11.43 11.75,8.89 10.79,7.94 9.53,7.94 8.57,6.99 8.57,6.03 7.3,4.76 U5.2 6.99,4.76
  Bottom 0.406: D1.2 7.18,4.58 U5.2
VCAP1  (via drill 0.33)
  Bottom 0.305: v23.81,15.56 23.8,15.54 C14.1 22.84,15.56 22.23,15.56 21.8,15.14 U4.49
VCAP2
  Bottom 0.305: U4.73 8.34,10.89 C13.1
VCC  (via drill 0.33)
  Top 0.305: LED1.A 2.79,32.77 v2.86,32.7
  Top 0.406: U2.P$4 20.6,28.86 20,28.26 19.1,28.26 C23.1 C3.1 18.4,27 v18.1,27.3 18.11,27.32
  Bottom 0.254: U4.100 5.62,27.72 4.45,28.89 3.83,28.89 C12.1 2.87,28.91 v2.86,28.89 | R1.2 2.87,22.53 v2.86,22.54 | R2.2 2.87,26.37 v2.86,26.35
  Bottom 0.305: v18.1,31.11 18.08,31.1 C7.2 18.1,30.15 18.1,29.53 17.84,29.27 U4.22 U4.21 | 9.53,30.15 C10.1 | v23.81,25.08 23.8,25.07 C9.2 22.84,25.08 22.23,25.08 21.67,25.64 U4.28 | v23.81,14.29 23.8,14.3 C6.2 22.84,14.29 22.23,14.29 21.88,14.64 U4.50 | v12.06,31.11 12.08,31.1 C8.1 12.06,30.15 12.06,29.53 12.34,29.26 U4.11 | 9.53,30.15 v9.53,31.11 | 9.53,30.15 9.53,29.53 9.84,29.22 U4.6 | v15.56,31.11 15.54,31.1 C1.2 15.56,30.15 15.56,29.84 16.34,29.07 U4.19 | U3.5 20.84,5.6 20.32,5.08 19.7,5.08 C20.1 18.75,5.09 v18.73,5.08 | v5.71,9.84 5.7,9.86 C11.1 5.71,10.81 5.71,11.11 7.33,12.73 U4.75 | 13.67,6.68 13.67,6.05 v13.65,6.03 | R3.1 23.8,27.61 v23.81,27.62
  Bottom 0.406: R4.2 13.67,6.68
  pour Route2 (isolate 0.254): 0,0 0,35.88 25.72,35.88 25.72,0
VIN
  Bottom 0.305: U3.2 U3.3 22.29,3.86 | U3.16 U3.15 24.52,6.1 24.77,6.35 24.77,10.16 24.13,10.79 22.86,10.79 22.21,10.14 C17.1 22.23,8.88 22.23,8.26 22.29,8.19 U3.10
  Bottom 0.406: U3.1 23.29,4.65 23.5,4.45 23.5,3.83 C15.1 | U3.1 U3.2 | 22.29,3.86 C16.1 22.24,2.24 20.64,0.64 5.4,0.64 4.88,1.15 D2.1 D1.1 | U3.1 23.68,4.95 23.94,5.21 U3.16
VSYNC  (via drill 0.33)
  Top 0.203: U1.P$7 10.73,15.3 10.48,15.56 10.48,20 v10.16,20.32
  Bottom 0.203: v10.16,20.32 9.53,20.32 6.71,23.14 U4.93
XCLK  (via drill 0.33)
  Top 0.203: U1.P$13 13.73,16.59 v13.97,16.83
  Bottom 0.203: U4.40 16.78,19.64 v13.97,16.83

### Text on the board
tPlace: BOOT | RST | RXD | TXD | OpenMV | R2 | VCC | GND | SWCK | SWIO